# EasyEDA Pro project moss-controller-pcb.eprj, schematic Schematic1

## Sheets
1 P1: Create Date: 2023-03-15; Page Name: P1; Project Name: moss-controller-pcb; Schematic Name: Schematic1; Update Date: 2023-04-03; Company: 嘉立创EDA; Page Size: A4; Version: V1.0
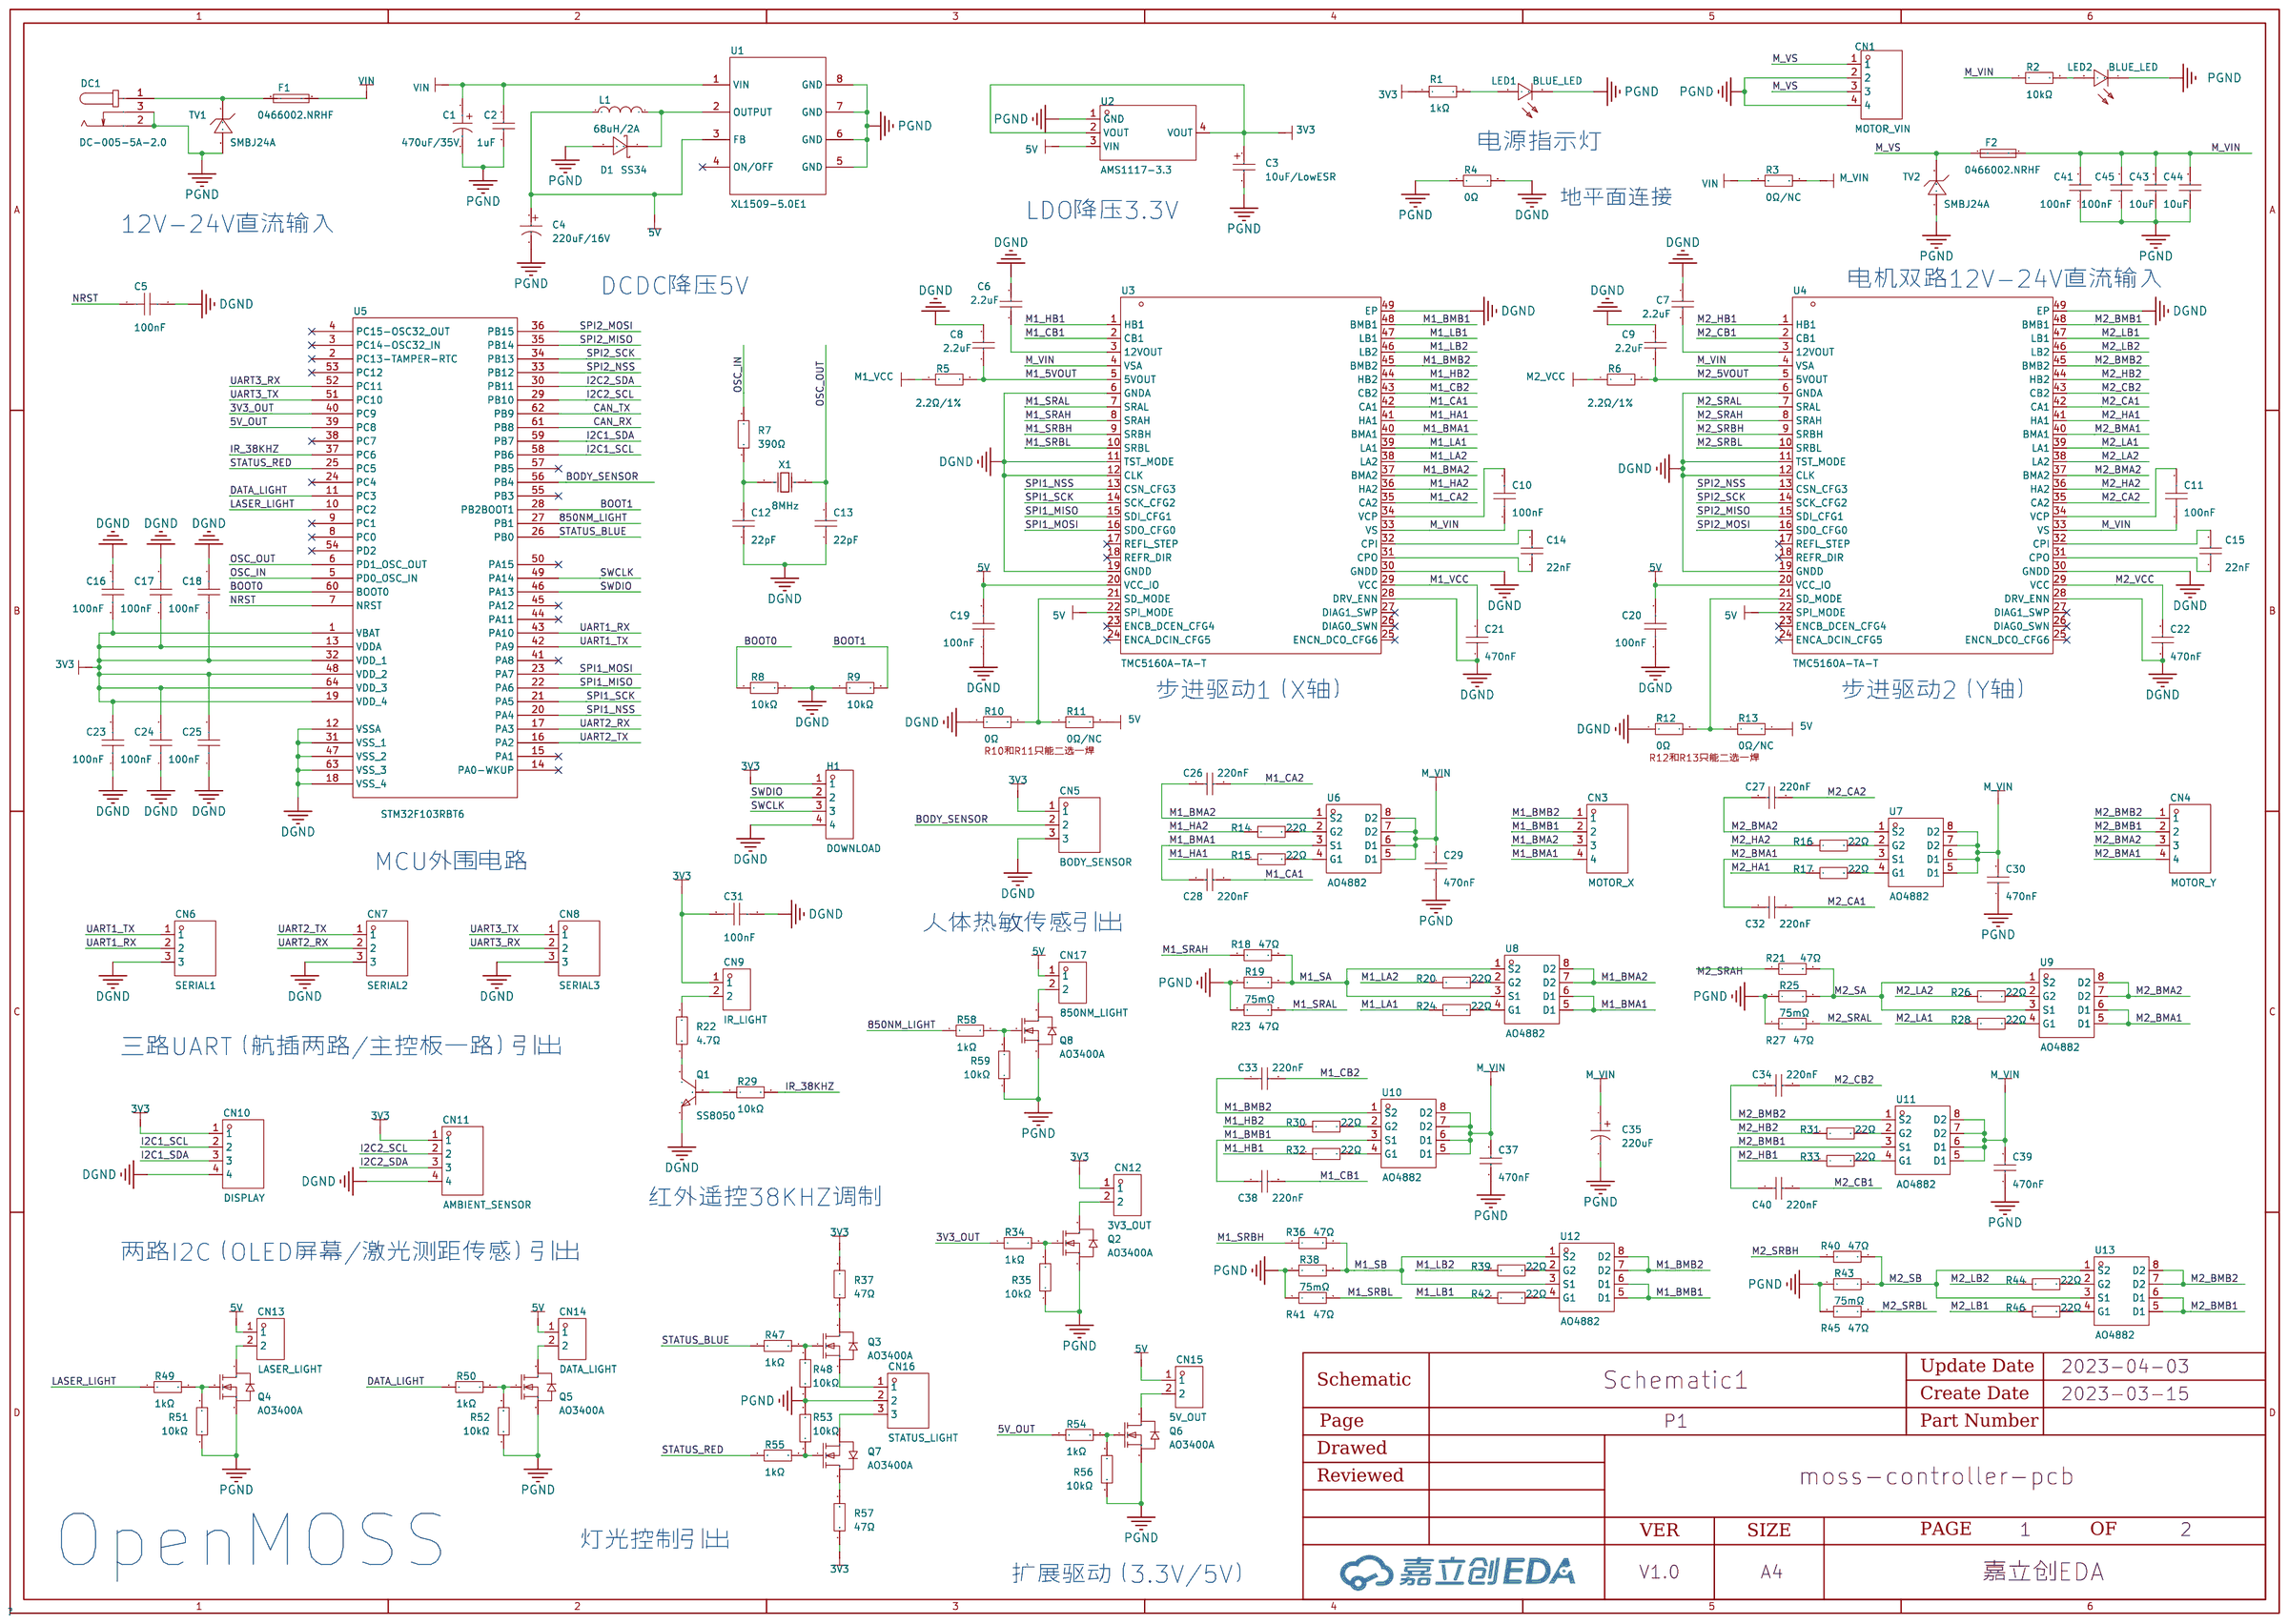
[diagram p0: P1]
2 P2: Create Date: 2023-04-05; Page Name: P2; Update Date: 2023-04-05
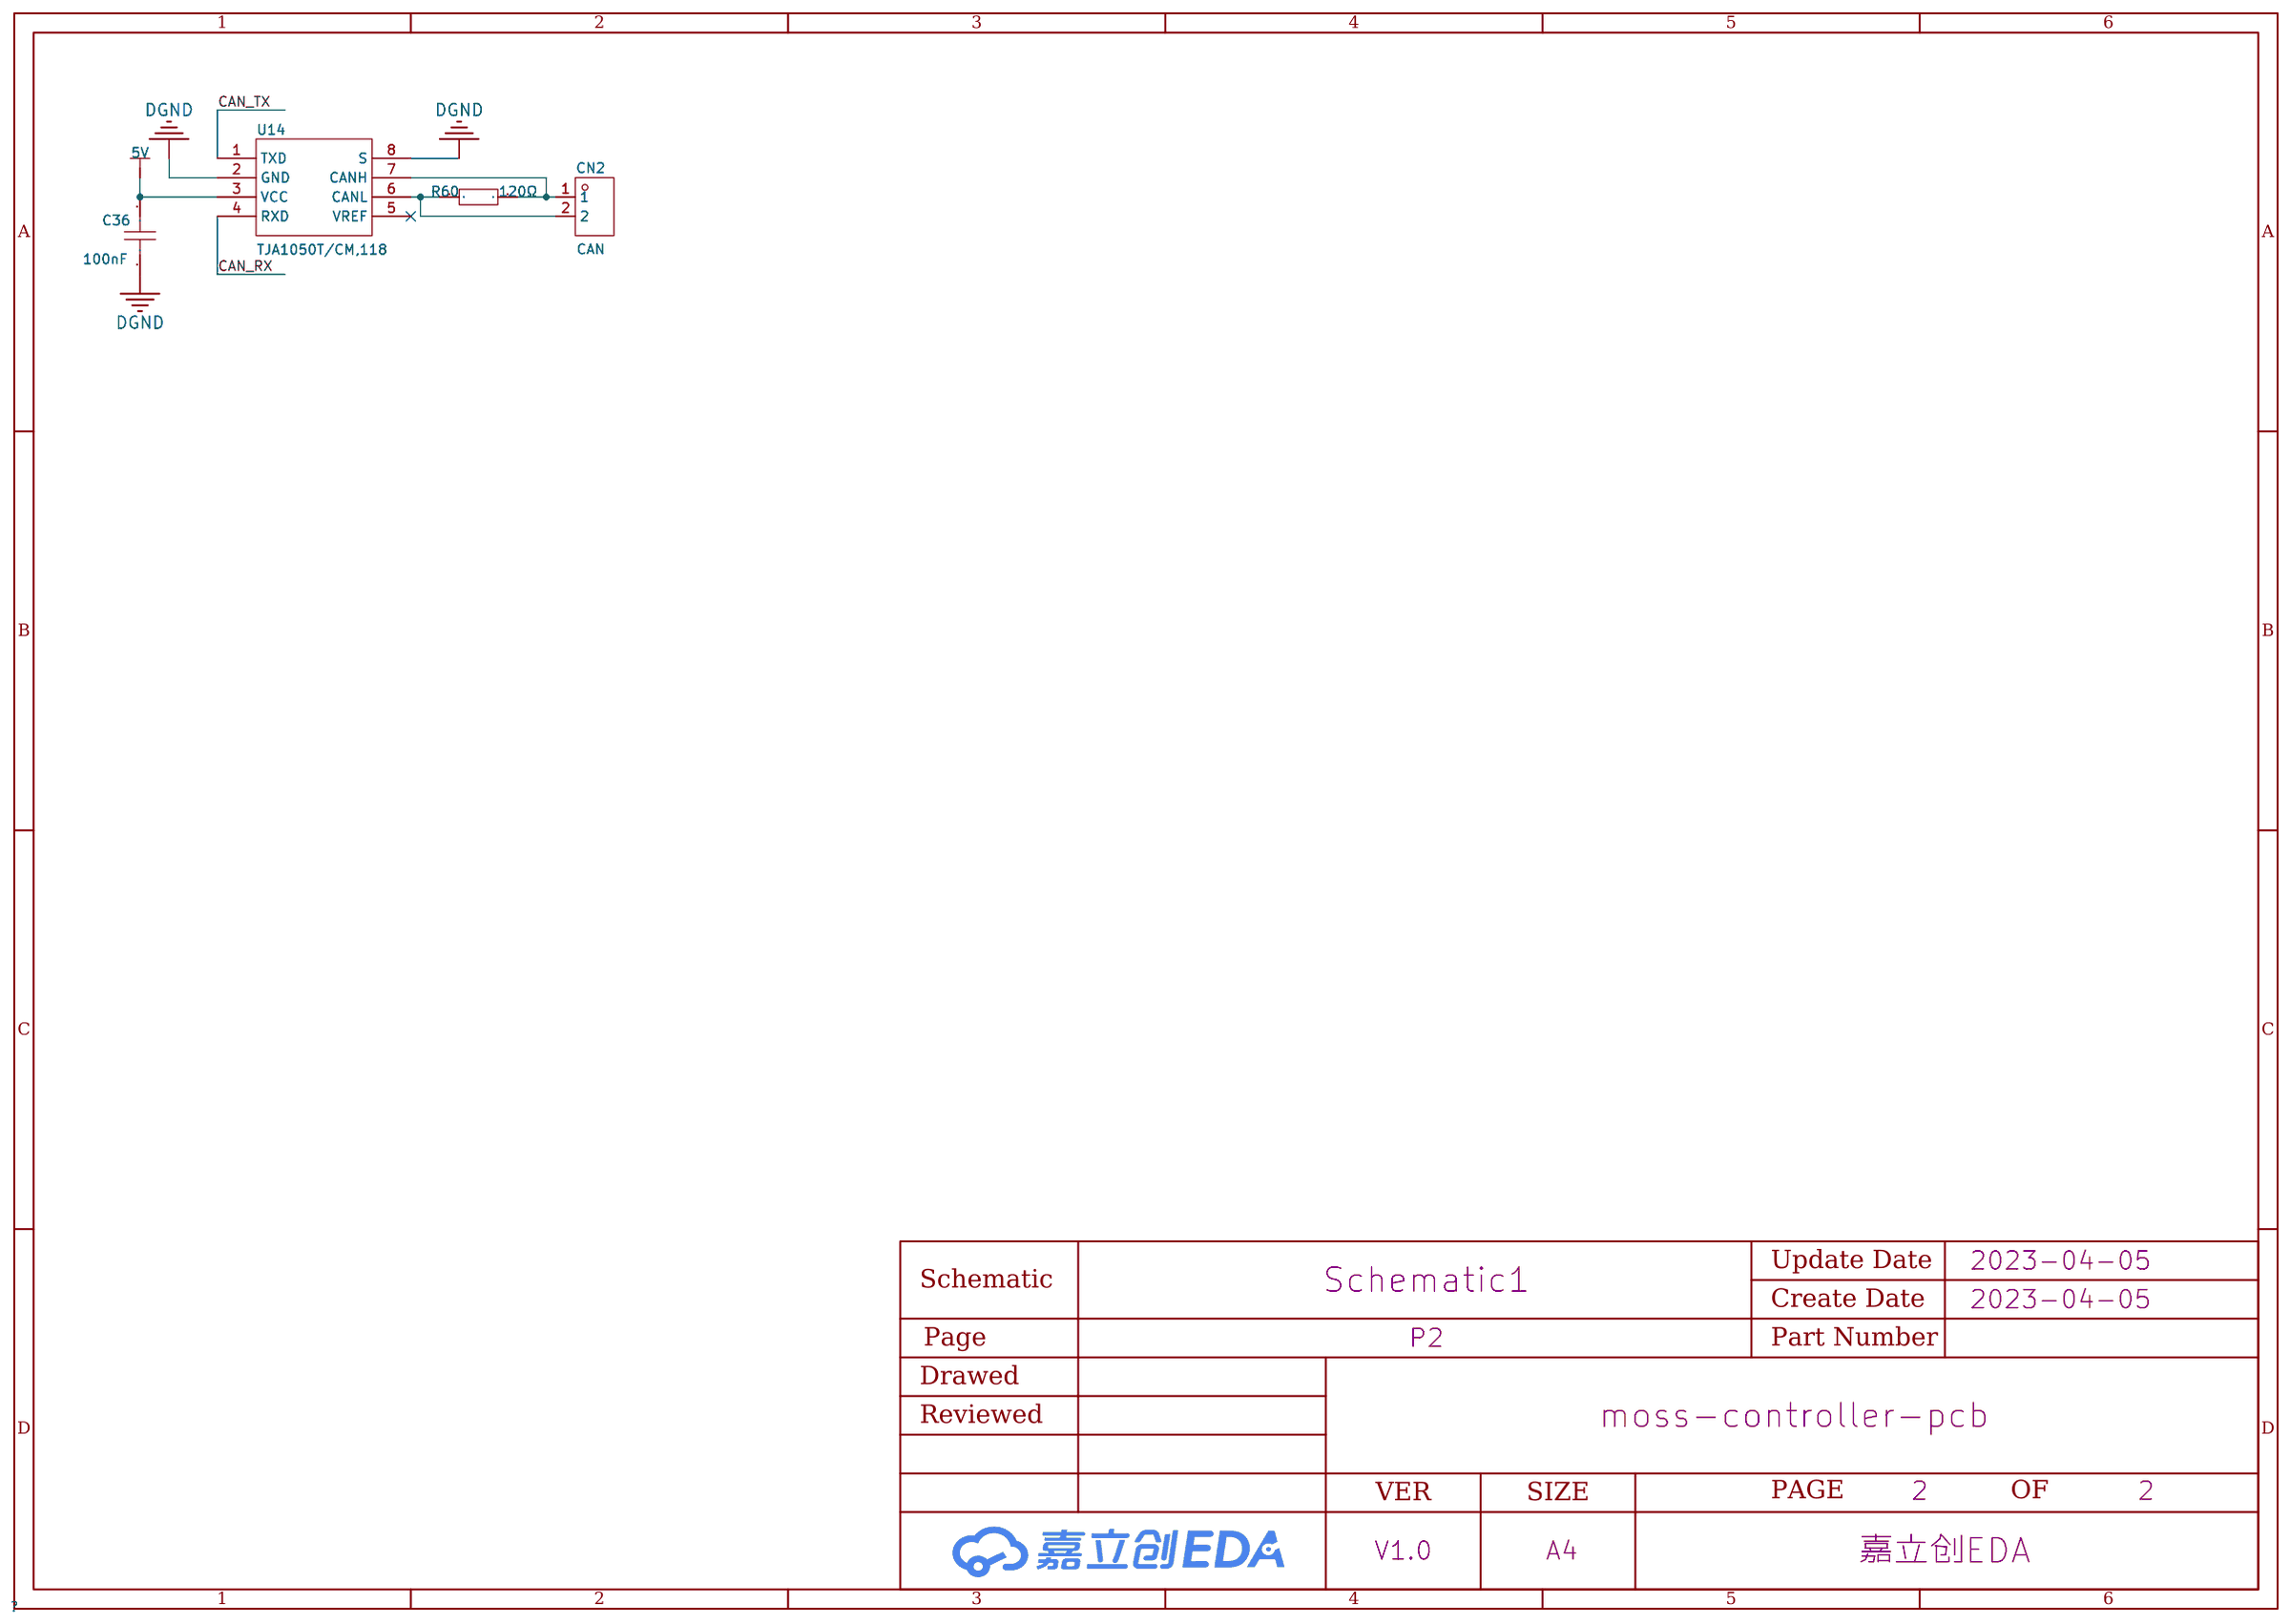
[diagram p1: P2]

## Parts
sheet P1
C1  470uF/35V  [CAP-TH_BD8.0-P3.50-D0.6-FD]
C2  1uF  [C0805]
C3  10uF/LowESR  [CAP-SMD_L3.2-W1.6-RD-C7171]
C4  220uF/16V  [CAP-TH_BD6.3-P2.50-D1.0-FD]
C5  100nF  [C0603]
C6  2.2uF  [C0805]
C7  2.2uF  [C0805]
C8  2.2uF  [C0805]
C9  2.2uF  [C0805]
C10  100nF  [C0603]
C11  100nF  [C0603]
C12  22pF  [C0603]
C13  22pF  [C0603]
C14  22nF  [C0603]
C15  22nF  [C0603]
C16  100nF  [C0603]
C17  100nF  [C0603]
C18  100nF  [C0603]
C19  100nF  [C0603]
C20  100nF  [C0603]
C21  470nF  [C0603]
C22  470nF  [C0603]
C23  100nF  [C0603]
C24  100nF  [C0603]
C25  100nF  [C0603]
C26  220nF  [C0603]
C27  220nF  [C0603]
C28  220nF  [C0603]
C29  470nF  [C0603]
C30  470nF  [C0603]
C31  100nF  [C0603]
C32  220nF  [C0603]
C33  220nF  [C0603]
C34  220nF  [C0603]
C35  220uF  [CAP-TH_BD8.0-P3.50-D0.6-FD-2]
C37  470nF  [C0603]
C38  220nF  [C0603]
C39  470nF  [C0603]
C40  220nF  [C0603]
C41  100nF  [C0805]
C43  10uF  [C1206]
C44  10uF  [C1206]
C45  100nF  [C0805]
CN1  MOTOR_VIN  [CONN-TH_A2501WR-4P]
CN3  MOTOR_X  [CONN-TH_A2501WR-4P]
CN4  MOTOR_Y  [CONN-TH_A2501WR-4P]
CN5  BODY_SENSOR  [CONN-TH_A2501WR-3P]
CN6  SERIAL1  [CONN-TH_A2501WR-3P]
CN7  SERIAL2  [CONN-TH_A2501WR-3P]
CN8  SERIAL3  [CONN-TH_A2501WR-3P]
CN9  IR_LIGHT  [CONN-TH_A2501WRB-2P]
CN10  DISPLAY  [CONN-TH_A2501WR-4P]
CN11  AMBIENT_SENSOR  [CONN-TH_A2501WR-4P]
CN12  3V3_OUT  [CONN-TH_A2501WRB-2P]
CN13  LASER_LIGHT  [CONN-TH_A2501WRB-2P]
CN14  DATA_LIGHT  [CONN-TH_A2501WRB-2P]
CN15  5V_OUT  [CONN-TH_A2501WRB-2P]
CN16  STATUS_LIGHT  [CONN-TH_A2501WR-3P]
CN17  850NM_LIGHT  [CONN-TH_A2501WRB-2P]
D1  SS34  [SMA_L4.3-W2.6-LS5.2-RD]
DC1  DC-005-5A-2.0  [DC-IN-TH_DC-005-5A-2.0]
F1  0466002.NRHF  [F1206]
F2  0466002.NRHF  [F1206]
H1  DOWNLOAD  [HDR-TH_4P-P2.54-V-F-3]
L1  68uH/2A  [IND-SMD_L7.1-W6.6]
LED1  BLUE_LED  [LED0603-RD]
LED2  BLUE_LED  [LED0603-RD]
Q1  SS8050  [SOT-23-3_L2.9-W1.3-P1.90-LS2.4-BR]
Q2  AO3400A  [SOT-23-3_L2.9-W1.3-P1.90-LS2.4-BR]
Q3  AO3400A  [SOT-23-3_L2.9-W1.3-P1.90-LS2.4-BR]
Q4  AO3400A  [SOT-23-3_L2.9-W1.3-P1.90-LS2.4-BR]
Q5  AO3400A  [SOT-23-3_L2.9-W1.3-P1.90-LS2.4-BR]
Q6  AO3400A  [SOT-23-3_L2.9-W1.3-P1.90-LS2.4-BR]
Q7  AO3400A  [SOT-23-3_L2.9-W1.3-P1.90-LS2.4-BR]
Q8  AO3400A  [SOT-23-3_L2.9-W1.3-P1.90-LS2.4-BR]
R1  1kΩ  [R0603]
R2  10kΩ  [R0603]
R3  0Ω/NC  [R1206]
R4  0Ω  [R0805]
R5  2.2Ω/1%  [R0603]
R6  2.2Ω/1%  [R0603]
R7  390Ω  [R0603]
R8  10kΩ  [R0603]
R9  10kΩ  [R0603]
R10  0Ω  [R0603]
R11  0Ω/NC  [R0603]
R12  0Ω  [R0603]
R13  0Ω/NC  [R0603]
R14  22Ω  [R0603]
R15  22Ω  [R0603]
R16  22Ω  [R0603]
R17  22Ω  [R0603]
R18  47Ω  [R0603]
R19  75mΩ  [R1206]
R20  22Ω  [R0603]
R21  47Ω  [R0603]
R22  4.7Ω  [R0603]
R23  47Ω  [R0603]
R24  22Ω  [R0603]
R25  75mΩ  [R1206]
R26  22Ω  [R0603]
R27  47Ω  [R0603]
R28  22Ω  [R0603]
R29  10kΩ  [R0603]
R30  22Ω  [R0603]
R31  22Ω  [R0603]
R32  22Ω  [R0603]
R33  22Ω  [R0603]
R34  1kΩ  [R0603]
R35  10kΩ  [R0603]
R36  47Ω  [R0603]
R37  47Ω  [R0603]
R38  75mΩ  [R1206]
R39  22Ω  [R0603]
R40  47Ω  [R0603]
R41  47Ω  [R0603]
R42  22Ω  [R0603]
R43  75mΩ  [R1206]
R44  22Ω  [R0603]
R45  47Ω  [R0603]
R46  22Ω  [R0603]
R47  1kΩ  [R0603]
R48  10kΩ  [R0603]
R49  1kΩ  [R0603]
R50  1kΩ  [R0603]
R51  10kΩ  [R0603]
R52  10kΩ  [R0603]
R53  10kΩ  [R0603]
R54  1kΩ  [R0603]
R55  1kΩ  [R0603]
R56  10kΩ  [R0603]
R57  47Ω  [R0603]
R58  1kΩ  [R0603]
R59  10kΩ  [R0603]
TV1  SMBJ24A  [SMB_L4.6-W3.6-LS5.3-RD]
TV2  SMBJ24A  [SMB_L4.6-W3.6-LS5.3-RD]
U1  XL1509-5.0E1  [SOIC-8_L5.0-W4.0-P1.27-LS6.0-BL]
U2  AMS1117-3.3  [SOT-223-3_L6.5-W3.4-P2.30-LS7.0-BR]
U3  TMC5160A-TA-T  [TQFP-48_L7.0-W7.0-P0.50-LS9.0-BL-EP]
U4  TMC5160A-TA-T  [TQFP-48_L7.0-W7.0-P0.50-LS9.0-BL-EP]
U5  STM32F103RBT6  [LQFP-64_L10.0-W10.0-P0.50-LS12.0-BL]
U6  AO4882  [SOIC-8_L4.9-W3.9-P1.27-LS6.0-BL]
U7  AO4882  [SOIC-8_L4.9-W3.9-P1.27-LS6.0-BL]
U8  AO4882  [SOIC-8_L4.9-W3.9-P1.27-LS6.0-BL]
U9  AO4882  [SOIC-8_L4.9-W3.9-P1.27-LS6.0-BL]
U10  AO4882  [SOIC-8_L4.9-W3.9-P1.27-LS6.0-BL]
U11  AO4882  [SOIC-8_L4.9-W3.9-P1.27-LS6.0-BL]
U12  AO4882  [SOIC-8_L4.9-W3.9-P1.27-LS6.0-BL]
U13  AO4882  [SOIC-8_L4.9-W3.9-P1.27-LS6.0-BL]
X1  8MHz  [CRYSTAL-SMD_L11.5-W4.8-LS12.7]
sheet P2
C36  100nF  [C0603]
CN2  CAN  [CONN-TH_A2501WRB-2P]
R60  120Ω  [R0603]
U14  TJA1050T/CM,118  [SOIC-8_L5.0-W4.0-P1.27-LS6.0-BL]

## Library data of the parts
C1 = SPT1VM471F14OR: 类型:-;容值:470uF;精度:±20%;额定电压:35V;电容体直径:8mm;电容体长度:14mm;脚间距:3.5mm;纹波电流:-;等效串联电阻:-;工作寿命:2000hrs@105℃;工作温度:-55℃~+105℃;; LCSC Part Name: 470uF ±20% 35V; Supplier Part: C698134; Manufacturer: Yunxing(云星); Supplier Footprint: 插件,8x14mm; JLCPCB Part Class: Extended Part; Datasheet: https://atta.szlcsc.com/upload/public/pdf/source/20200709/C697725_42901235359D2F905A7BBBDFFA1D5D23.pdf; Supplier: LCSC; Tolerance: ±20%; Rated Voltage: 35V; φD: 8mm; L: 14mm; Lead Spacing: 3.5mm; Lifetime @ Temp: 2000hrs@105℃; Operating Temperature: -55℃~+105℃
C2 = CL21B105KBFNNNE: 容值:1uF;精度:±10%;额定电压:50V;材质(温度系数):X7R;; LCSC Part Name: 1uF ±10% 50V; Supplier Part: C28323; Manufacturer: SAMSUNG(三星); Supplier Footprint: 0805; JLCPCB Part Class: Basic Part; Datasheet: https://atta.szlcsc.com/upload/public/pdf/source/20160103/1457707718219.pdf; Supplier: LCSC; Tolerance: ±10%; Voltage Rated: 50V; Temperature Coefficient: X7R
C3 = TAJA106K016RNJ: 容值:10uF;精度:±10%;额定电压:16V;等效串联电阻:3Ω@100kHz;工作温度:-55℃~+125℃;; LCSC Part Name: 10uF ±10% 16V; Supplier Part: C7171; Manufacturer: Kyocera AVX; Supplier Footprint: CASE-A-3216; JLCPCB Part Class: Basic Part; Datasheet: https://atta.szlcsc.com/upload/public/pdf/source/20160107/1457707748093.pdf; Supplier: LCSC; Tolerance: ±10%; Rated Voltage: 16V; Equivalent Series Resistance(ESR): 3Ω@100kHz; Operating Temperature: -55℃~+125℃
C4 = SPZ1CM221E08O00RAXXX: 类型:-;容值:220uF;精度:±20%;额定电压:16V;电容体直径:6.3mm;电容体长度:8mm;脚间距:2.5mm;纹波电流:2.7A@100kHz;等效串联电阻:20mΩ@100kHz;工作寿命:2000hrs@105℃;工作温度:-55℃~+105℃;; LCSC Part Name: 220uF ±20% 16V; Supplier Part: C122241; Manufacturer: AISHI(艾华集团); Supplier Footprint: 径向引线,6.3x8mm; JLCPCB Part Class: Extended Part; Datasheet: https://atta.szlcsc.com/upload/public/pdf/source/20170721/C122241_1500619281644834030.pdf; Supplier: LCSC; Tolerance: ±20%; Rated Voltage: 16V; φD: 6.3mm; L: 8mm; Lead Spacing: 2.5mm; Ripple Current: 2.7A@100kHz; Equivalent Series Resistance(ESR): 20mΩ@100kHz; Lifetime @ Temp: 2000hrs@105℃; Operating Temperature: -55℃~+105℃
C5 C10 C11 C16-C20 C23-C25 C31 C36 = CL10B104KB8NNNC: 容值:100nF;精度:±10%;额定电压:50V;材质(温度系数):X7R;; LCSC Part Name: 100nF ±10% 50V; Supplier Part: C1591; Manufacturer: SAMSUNG(三星); Supplier Footprint: 0603; JLCPCB Part Class: Extended Part; Datasheet: https://atta.szlcsc.com/upload/public/pdf/source/20160103/1457707680512.pdf; Supplier: LCSC; Tolerance: ±10%; Voltage Rated: 50V; Temperature Coefficient: X7R
C6-C9 = 0805F225M500NT: 容值:2.2uF;精度:±20%;额定电压:50V;材质(温度系数):Y5V;; LCSC Part Name: 2.2uF ±20% 50V; Supplier Part: C49217; Manufacturer: FH(风华); Supplier Footprint: 0805; JLCPCB Part Class: Basic Part; Datasheet: https://atta.szlcsc.com/upload/public/pdf/source/20170923/C49217_1506149476408988807.pdf; Supplier: LCSC; Tolerance: ±20%; Voltage Rated: 50V; Temperature Coefficient: Y5V
C12 C13 = CL10C220JB8NNNC: 容值:22pF;精度:±5%;额定电压:50V;材质(温度系数):C0G;; LCSC Part Name: 22pF ±5% 50V; Supplier Part: C1653; Manufacturer: SAMSUNG(三星); Supplier Footprint: 0603; JLCPCB Part Class: Basic Part; Datasheet: https://atta.szlcsc.com/upload/public/pdf/source/20160103/1457707687317.pdf; Supplier: LCSC; Tolerance: ±5%; Voltage Rated: 50V; Temperature Coefficient: C0G
C14 C15 = CL10B223KB8NNNC: 容值:22nF;精度:±10%;额定电压:50V;材质(温度系数):X7R;; LCSC Part Name: 22nF ±10% 50V; Supplier Part: C21122; Manufacturer: SAMSUNG(三星); Supplier Footprint: 0603; JLCPCB Part Class: Basic Part; Datasheet: https://atta.szlcsc.com/upload/public/pdf/source/20160103/1457707705232.pdf; Supplier: LCSC; Tolerance: ±10%; Voltage Rated: 50V; Temperature Coefficient: X7R
C21 C22 C29 C30 C37 C39 = CL10B474KA8NNNC: 容值:470nF;精度:±10%;额定电压:25V;材质(温度系数):X7R;; LCSC Part Name: 470nF ±10% 25V; Supplier Part: C1623; Manufacturer: SAMSUNG(三星); Supplier Footprint: 0603; JLCPCB Part Class: Basic Part; Datasheet: https://atta.szlcsc.com/upload/public/pdf/source/20160103/1457707685435.pdf; Supplier: LCSC; Tolerance: ±10%; Voltage Rated: 25V; Temperature Coefficient: X7R
C26-C28 C32-C34 C38 C40 = CL10B224KA8NNNC: 容值:220nF;精度:±10%;额定电压:25V;材质(温度系数):X7R;; LCSC Part Name: 220nF ±10% 25V; Supplier Part: C21120; Manufacturer: SAMSUNG(三星); Supplier Footprint: 0603; JLCPCB Part Class: Basic Part; Datasheet: https://atta.szlcsc.com/upload/public/pdf/source/20160103/1457707705031.pdf; Supplier: LCSC; Tolerance: ±10%; Voltage Rated: 25V; Temperature Coefficient: X7R
C35 = KNH2220UF35V149EC0049: 容值:220uF;精度:±20%;额定电压:35V;电容体直径:8mm;电容体长度:9mm;脚间距:3.5mm;纹波电流:1.7A@100kHz;等效串联电阻:40mΩ@100kHz;工作寿命:2000hrs@105℃;工作温度:-55℃~+105℃;; LCSC Part Name: 220uF ±20% 35V; Supplier Part: C2981462; Manufacturer: KNSCHA(科尼盛); Supplier Footprint: 径向引线,8x9mm; JLCPCB Part Class: Extended Part; Datasheet: https://atta.szlcsc.com/upload/public/pdf/source/20220426/9FC8A158D93B909CC105160B4A0CB698.pdf; Supplier: LCSC; Tolerance: ±20%; Rated Voltage: 35V; φD: 8mm; L: 9mm; Lead Spacing: 3.5mm; Ripple Current: 1.7A@100kHz; Equivalent Series Resistance(ESR): 40mΩ@100kHz; Lifetime @ Temp: 2000hrs@105℃; Operating Temperature: -55℃~+105℃
C41 C45 = CC0805KRX7R9BB104: 容值:100nF;精度:±10%;额定电压:50V;材质(温度系数):X7R;; LCSC Part Name: 100nF ±10% 50V; Supplier Part: C49678; Manufacturer: YAGEO(国巨); Supplier Footprint: 0805; JLCPCB Part Class: Basic Part; Datasheet: https://atta.szlcsc.com/upload/public/pdf/source/20151026/1457707504898.pdf; Supplier: LCSC; Tolerance: ±10%; Voltage Rated: 50V; Temperature Coefficient: X7R
C43 C44 = CL31A106KBHNNNE: 容值:10uF;精度:±10%;额定电压:50V;材质(温度系数):X5R;; LCSC Part Name: 10uF ±10% 50V; Supplier Part: C13585; Manufacturer: SAMSUNG(三星); Supplier Footprint: 1206; JLCPCB Part Class: Basic Part; Datasheet: https://atta.szlcsc.com/upload/public/pdf/source/20160103/1457707668742.pdf; Supplier: LCSC; Tolerance: ±10%; Voltage Rated: 50V; Temperature Coefficient: X5R
CN1 CN3 CN4 CN10 CN11 = A2501WR-4P: 参考系列:XH;间距:2.5mm;插针结构:1x4P;排数:1;每排PIN数:4;行距:-;安装方式:-;触头材质:黄铜;; LCSC Part Name: XH 2.5mm 1x4P 镀锡; Supplier Part: C225401; Manufacturer: CJT(长江连接器); Supplier Footprint: 弯插,P=2.5mm; JLCPCB Part Class: Extended Part; Datasheet: https://atta.szlcsc.com/upload/public/pdf/source/20180509/C225401_3AFE88A4096D5C39E59878F7D4C1EC6D.pdf; Supplier: LCSC; Reference Series: XH; Pitch: 2.5mm; Pins Structure: 1x4P; Number of Rows: 1; Number of PINs Per Row: 4; Contact Material: 黄铜
CN5-CN8 CN16 = A2501WR-3P: 参考系列:XH;间距:2.5mm;插针结构:1x3P;排数:1;每排PIN数:3;行距:-;安装方式:-;触头材质:黄铜;; LCSC Part Name: XH 2.5mm 1x3P 镀锡; Supplier Part: C225400; Manufacturer: CJT(长江连接器); Supplier Footprint: 插件,P=2.5mm; JLCPCB Part Class: Extended Part; Datasheet: https://atta.szlcsc.com/upload/public/pdf/source/20180509/C225400_702E0154C4A2B4B6D4A16C0687A1836E.pdf; Supplier: LCSC; Reference Series: XH; Pitch: 2.5mm; Pins Structure: 1x3P; Number of Rows: 1; Number of PINs Per Row: 3; Contact Material: 黄铜
CN2 CN9 CN12-CN15 CN17 = A2501WRB-2P: 参考系列:XH;间距:2.5mm;插针结构:1x2P;排数:1;每排PIN数:2;行距:-;安装方式:-;触头材质:黄铜;; LCSC Part Name: XH 2.5mm 1x2P 镀锡; Supplier Part: C273216; Manufacturer: CJT(长江连接器); Supplier Footprint: 插件,P=2.5mm; JLCPCB Part Class: Extended Part; Datasheet: https://atta.szlcsc.com/upload/public/pdf/source/20180913/C273216_C0F0FBC6365BAF736D2CFBE208868BED.pdf; Supplier: LCSC; Reference Series: XH; Pitch: 2.5mm; Pins Structure: 1x2P; Number of Rows: 1; Number of PINs Per Row: 2; Contact Material: 黄铜
D1 = SS34_C8678: 二极管配置:独立式;直流反向耐压(Vr):40V;平均整流电流(Io):3A;正向压降(Vf):550mV@3A;反向电流(Ir):500uA@40V;; LCSC Part Name: 40V 3A 550mV@3A; Supplier Part: C8678; Manufacturer: MDD; Supplier Footprint: SMA(DO-214AC); JLCPCB Part Class: Basic Part; Datasheet: https://atta.szlcsc.com/upload/public/pdf/source/20230314/A80AE34493C69B89E2F4B1712F433538.pdf; Supplier: LCSC; Diode Configuration: 独立式; Reverse Voltage (Vr): 40V; Average Rectified Current (Io): 3A; Forward Voltage (Vf@If): 550mV@3A; Reverse Leakage Current (Ir): 500uA@40V
DC1 = DC-005-5A-2.0: 连接器类型:DC电源插座;触点内径:2mm;触点外径:6.2mm;额定电流:5A;额定电压:24V;触头材质:黄铜;工作温度范围:-20℃~+70℃;焊接温度(最大值):260℃;; LCSC Part Name: DC电源插座 内径:2mm 外径:6.2mm; Supplier Part: C381116; Manufacturer: XKB Connectivity(中国星坤); Supplier Footprint: 插件; JLCPCB Part Class: Extended Part; Datasheet: https://atta.szlcsc.com/upload/public/pdf/source/20211015/707A35F7AB6E89C57AAB641950105BB7.pdf; Supplier: LCSC; Connector Type: DC电源插座; Inside Contact Diameter: 2mm; Outside Contact Diameter: 6.2mm; Current Rating (Max): 5A; Voltage Rating (Max): 24V; Contact Material: 黄铜; Operating Temperature Range: -20℃~+70℃; Welding Temperature (Max): 260℃
F1 F2 = 0466002.NRHF: 类型:贴片式保险丝;额定电流:2A;额定电压 (AC):63V;额定电压 (DC):63V;分断能力:50A;工作温度:-55℃~+90℃;; LCSC Part Name: 2A 63V 快断; Supplier Part: C3105; Manufacturer: Littelfuse(美国力特); Supplier Footprint: 1206; JLCPCB Part Class: Extended Part; Datasheet: https://atta.szlcsc.com/upload/public/pdf/source/20151106/1457707546362.pdf; Supplier: LCSC; Type: 贴片式保险丝; Current Rating: 2A; Voltage Rating  (AC): 63V; Voltage Rating (DC): 63V; Breaking Capacity: 50A; Operating Temperature: -55℃~+90℃
H1 = MF254V-11-04-0540: 排数:单排;总孔位数:4;间距:2.54mm;插孔结构:1x4P;行距:-;安装类型:直插;圆孔/方孔:圆孔;额定电流:3A;额定电压:-;插孔方向:顶部;塑高:3mm;工作温度范围:-40℃~+105℃;; LCSC Part Name: 2.54mm 1x4P; Supplier Part: C509262; Manufacturer: XFCN(兴飞); Supplier Footprint: 插件,P=2.54mm; JLCPCB Part Class: Extended Part; Datasheet: https://atta.szlcsc.com/upload/public/pdf/source/20200407/C509262_774DD75DBF2E5657535A5D67C193029B.pdf; Supplier: LCSC; Number of Rows: 单排; Number of Holes: 4; Pitch: 2.54mm; Holes Structure: 1x4P; Mounting Type: 直插; Circular Hole / Square Hole: 圆孔; Current Rating (Max): 3A; Holes Direction: 顶部; Insulation Height: 3mm; Operating Temperature Range: -40℃~+105℃
L1 = SMMS0650-680M: 电感值:68uH;精度:±20%;额定电流:1.5A;饱和电流(Isat):2A;直流电阻(DCR):340mΩ;; LCSC Part Name: 68uH ±20% 1.5A 340mΩ; Supplier Part: C2894721; Manufacturer: SXN(顺翔诺); Supplier Footprint: SMD,6.6x7.1mm; JLCPCB Part Class: Extended Part; Datasheet: https://atta.szlcsc.com/upload/public/pdf/source/20210910/523B6BB0C4A09F37806A127B1ABE761D.pdf; Supplier: LCSC; Tolerance: ±20%; Rated Current: 1.5A; Saturation Current (Isat): 2A; DC Resistance (DCR): 340mΩ
LED1 LED2 = 19-217/BHC-ZL1M2RY/3T: 照明颜色:蓝色;主波长/色坐标:465~475nm;; LCSC Part Name: 0603 蓝灯; Supplier Part: C72041; Manufacturer: EVERLIGHT(亿光); Supplier Footprint: 0603; JLCPCB Part Class: Basic Part; Datasheet: https://atta.szlcsc.com/upload/public/pdf/source/20170116/1484561237273.pdf; Supplier: LCSC; Mounting Type: 表面贴装; Illumination Color: 蓝色; Luminous Intensity (IF=20mA): 11.5~28.5mcd@5mA; Dominant Wavelength / Coordinate rank: 465~475nm
Q1 = SS8050_C2150: 晶体管类型:NPN;集射极击穿电压(Vceo):25V;集电极电流(Ic):1.5A;功率(Pd):300mW;直流电流增益(hFE@Ic,Vce):200@100mA,1V;; LCSC Part Name: NPN 25V 1.5A Y1 200-350; Supplier Part: C2150; Manufacturer: CJ(江苏长电/长晶); Supplier Footprint: SOT-23; JLCPCB Part Class: Basic Part; Datasheet: https://atta.szlcsc.com/upload/public/pdf/source/20230322/AEE86F4B043774EFF80CAEA14A37D9E9.pdf; Supplier: LCSC; Transistor Type: NPN; Collector-Emitter Breakdown Voltage (Vceo): 25V; Collector Current (Ic): 1.5A; Power Dissipation (Pd): 300mW; Collector Cut-Off Current (Icbo): 100nA; Collector-Emitter Saturation Voltage (VCE(sat)@Ic,Ib): 500mV@800mA,80mA; DC Current Gain (hFE@Ic,Vce): 200@100mA,1V; Transition Frequency (fT): 100MHz; Operating Temperature: +150℃@(Tj)
Q2-Q8 = AO3400A_C347475: 类型:N沟道;漏源电压(Vdss):30V;连续漏极电流(Id):5.8A;功率(Pd):1.4W;导通电阻(RDS(on)@Vgs,Id):35mΩ@10V,5.8A;阈值电压(Vgs(th)@Id):1.4V@250uA;栅极电荷(Qg@Vgs):-;输入电容(Ciss@Vds):-;反向传输电容(Crss@Vds):-;; LCSC Part Name: N沟道 30V 5.8A; Supplier Part: C347475; Manufacturer: UMW(广东友台半导体); Supplier Footprint: SOT-23; JLCPCB Part Class: Extended Part; Datasheet: https://atta.szlcsc.com/upload/public/pdf/source/20220429/98B7D6B2B83615ED4523A0C76368EB06.pdf; Supplier: LCSC; Type: N沟道; Drain Source Voltage (Vdss): 30V; Continuous Drain Current (Id): 5.8A; Power Dissipation (Pd): 1.4W; Drain Source On Resistance (RDS(on)@Vgs,Id): 35mΩ@10V,5.8A; Gate Threshold Voltage (Vgs(th)@Id): 1.4V@250uA
R1 R34 R47 R49 R50 R54 R55 R58 = 0603WAF1001T5E: 电阻类型:厚膜电阻;阻值:1kΩ;精度:±1%;功率:100mW;温度系数:±100ppm/℃;最大工作电压:75V;工作温度范围:-55℃~+155℃;; LCSC Part Name: 1kΩ ±1% 100mW; Supplier Part: C21190; Manufacturer: UNI-ROYAL(厚声); Supplier Footprint: 0603; JLCPCB Part Class: Basic Part; Datasheet: https://atta.szlcsc.com/upload/public/pdf/source/20200306/C422600_1E6D84923E4A46A82E41ADD87F860B5C.pdf; Supplier: LCSC; Type: 厚膜电阻; Tolerance: ±1%; Power(Watts): 100mW; Temperature Coefficient: ±100ppm/℃; Overload Voltage (Max): 75V; Operating Temperature Range: -55℃~+155℃
R2 R8 R9 R29 R35 R48 R51-R53 R56 R59 = 0603WAF1002T5E: 电阻类型:厚膜电阻;阻值:10kΩ;精度:±1%;功率:100mW;温度系数:±100ppm/℃;最大工作电压:75V;工作温度范围:-55℃~+155℃;; LCSC Part Name: 10kΩ ±1% 100mW; Supplier Part: C25804; Manufacturer: UNI-ROYAL(厚声); Supplier Footprint: 0603; JLCPCB Part Class: Basic Part; Datasheet: https://atta.szlcsc.com/upload/public/pdf/source/20200306/C422600_1E6D84923E4A46A82E41ADD87F860B5C.pdf; Supplier: LCSC; Type: 厚膜电阻; Tolerance: ±1%; Power(Watts): 100mW; Temperature Coefficient: ±100ppm/℃; Overload Voltage (Max): 75V; Operating Temperature Range: -55℃~+155℃
R3 = 1206W4F0000T5E: 电阻类型:厚膜电阻;阻值:0Ω;精度:±1%;功率:250mW;温度系数:±800ppm/℃;最大工作电压:200V;工作温度范围:-55℃~+155℃;; LCSC Part Name: 0Ω ±1% 250mW; Supplier Part: C17888; Manufacturer: UNI-ROYAL(厚声); Supplier Footprint: 1206; JLCPCB Part Class: Basic Part; Datasheet: https://atta.szlcsc.com/upload/public/pdf/source/20200306/C422600_1E6D84923E4A46A82E41ADD87F860B5C.pdf; Supplier: LCSC; Type: 厚膜电阻; Tolerance: ±1%; Power(Watts): 250mW; Temperature Coefficient: ±800ppm/℃; Overload Voltage (Max): 200V; Operating Temperature Range: -55℃~+155℃
R4 = 0805W8F0000T5E: 电阻类型:厚膜电阻;阻值:0Ω;精度:±1%;功率:125mW;温度系数:±800ppm/℃;最大工作电压:150V;工作温度范围:-55℃~+155℃;; LCSC Part Name: 0Ω ±1% 125mW; Supplier Part: C17477; Manufacturer: UNI-ROYAL(厚声); Supplier Footprint: 0805; JLCPCB Part Class: Basic Part; Datasheet: https://atta.szlcsc.com/upload/public/pdf/source/20200306/C422600_1E6D84923E4A46A82E41ADD87F860B5C.pdf; Supplier: LCSC; Type: 厚膜电阻; Tolerance: ±1%; Power(Watts): 125mW; Temperature Coefficient: ±800ppm/℃; Overload Voltage (Max): 150V; Operating Temperature Range: -55℃~+155℃
R5 R6 = 0603WAF220KT5E: LCSC Part Name: 2.2Ω(2R20) ±1% 编带; Supplier Part: C22939; Manufacturer: UNI-ROYAL(厚声); Supplier Footprint: 0603; JLCPCB Part Class: Basic Part; Datasheet: https://atta.szlcsc.com/upload/public/pdf/source/20170920/C22939_1505900994379982327.pdf; Supplier: LCSC
R7 = 0603WAF3900T5E: 精度:±1%;温度系数:±100ppm/℃;功率:1/10W;阻值:390Ω;最大工作电压:75V;工作温度范围:-55℃~+155℃;; LCSC Part Name: 390Ω ±1%; Supplier Part: C23151; Manufacturer: UNI-ROYAL(厚声); Supplier Footprint: 0603; JLCPCB Part Class: Basic Part; Datasheet: https://atta.szlcsc.com/upload/public/pdf/source/20170920/C23151_1505901103965982535.pdf; Supplier: LCSC; Tolerance: ±1%; Temperature Coefficient: ±100ppm/℃; Power(Watts): 1/10W; Overload Voltage (Max): 75V; Operating Temperature Range: -55℃~+155℃
R10-R13 = 0603WAF0000T5E: 电阻类型:厚膜电阻;阻值:0Ω;精度:±1%;功率:100mW;最大工作电压:75V;工作温度范围:-55℃~+155℃;; LCSC Part Name: 0Ω ±1% 100mW; Supplier Part: C21189; Manufacturer: UNI-ROYAL(厚声); Supplier Footprint: 0603; JLCPCB Part Class: Basic Part; Datasheet: https://atta.szlcsc.com/upload/public/pdf/source/20200306/C422600_1E6D84923E4A46A82E41ADD87F860B5C.pdf; Supplier: LCSC; Type: 厚膜电阻; Tolerance: ±1%; Power(Watts): 100mW; Overload Voltage (Max): 75V; Operating Temperature Range: -55℃~+155℃
R14-R17 R20 R24 R26 R28 R30-R33 R39 R42 R44 R46 = 0603WAF220JT5E: 电阻类型:厚膜电阻;阻值:22Ω;精度:±1%;功率:100mW;温度系数:±100ppm/℃;最大工作电压:75V;工作温度范围:-55℃~+155℃;; LCSC Part Name: 22Ω ±1% 100mW; Supplier Part: C23345; Manufacturer: UNI-ROYAL(厚声); Supplier Footprint: 0603; JLCPCB Part Class: Basic Part; Datasheet: https://atta.szlcsc.com/upload/public/pdf/source/20200306/C422600_1E6D84923E4A46A82E41ADD87F860B5C.pdf; Supplier: LCSC; Type: 厚膜电阻; Tolerance: ±1%; Power(Watts): 100mW; Temperature Coefficient: ±100ppm/℃; Overload Voltage (Max): 75V; Operating Temperature Range: -55℃~+155℃
R18 R21 R23 R27 R36 R37 R40 R41 R45 R57 = 0603WAF470JT5E: 精度:±1%;温度系数:±100ppm/℃;阻值:47Ω;功率:1/10W;最大工作电压:75V;工作温度范围:-55℃~+155℃;; LCSC Part Name: 47Ω ±1%; Supplier Part: C23182; Manufacturer: UNI-ROYAL(厚声); Supplier Footprint: 0603; JLCPCB Part Class: Basic Part; Datasheet: https://atta.szlcsc.com/upload/public/pdf/source/20170920/C23182_1505901119737982565.pdf; Supplier: LCSC; Tolerance: ±1%; Temperature Coefficient: ±100ppm/℃; Power(Watts): 1/10W; Overload Voltage (Max): 75V; Operating Temperature Range: -55℃~+155℃
R19 R25 R38 R43 = 1206W4J075LT5E: 阻值:75mΩ;精度:±5%;功率:250mW;温度系数:±800ppm/℃;; LCSC Part Name: 75mΩ ±5% 250mW; Supplier Part: C127711; Manufacturer: UNI-ROYAL(厚声); Supplier Footprint: 1206; JLCPCB Part Class: Extended Part; Datasheet: https://atta.szlcsc.com/upload/public/pdf/source/20170821/C127711_1503303445338901692.pdf; Supplier: LCSC; Tolerance: ±5%; Power(Watts): 250mW; Temperature Coefficient: ±800ppm/℃
R22 = 0603WAF470KT5E: LCSC Part Name: 4.7Ω(4R70) ±1% 编带; Supplier Part: C23164; Manufacturer: UNI-ROYAL(厚声); Supplier Footprint: 0603; JLCPCB Part Class: Basic Part; Datasheet: https://atta.szlcsc.com/upload/public/pdf/source/20170920/C23164_1505901110674982547.pdf; Supplier: LCSC
TV1 TV2 = SMBJ24A_C87268: 极性:单向;反向截止电压(Vrwm):24V;击穿电压(最小值):26.7V;峰值脉冲电流(Ipp)@10/1000s:15.5A;最大钳位电压:38.9V;; LCSC Part Name: 单向 Vrwm:24V; Supplier Part: C87268; Manufacturer: Brightking(君耀电子); Supplier Footprint: SMB(DO-214AA); JLCPCB Part Class: Extended Part; Datasheet: https://atta.szlcsc.com/upload/public/pdf/source/20161123/1479873102111.pdf; Supplier: LCSC; Polarity: 单向; Reverse Stand-Off Voltage (Vrwm): 24V; Breakdown Voltage (Min): 26.7V; Peak Pulse Current (Ipp)@10/1000μs: 15.5A; Maximum Clamping Voltage: 38.9V
U1 = XL1509-5.0E1: 功能类型:降压型;同步整流:-;输出通道数:-;拓扑结构:-;输入电压:-;输出电流(最大值):-;开关频率:-;; LCSC Part Name: 降压型; Supplier Part: C61063; Manufacturer: XLSEMI(芯龙); Supplier Footprint: SOIC-8; JLCPCB Part Class: Basic Part; Datasheet: https://atta.szlcsc.com/upload/public/pdf/source/20151020/1457707483545.pdf; Supplier: LCSC; Function: 降压型
U2 = AMS1117-3.3_C6186: 输出类型:固定;输出极性:正;输出通道数:1;最大输入电压:-;输出电压:3.3V;压差:1.3V@(800mA);静态电流(地电流):-;输出电流:1A;电源纹波抑制比(PSRR):72dB@(120Hz);噪声:-;特性:-;工作温度:-;; LCSC Part Name: 正 Vout=3.3V 1A 72dB@(120Hz); Supplier Part: C6186; Manufacturer: AMS; Supplier Footprint: SOT-223-3; JLCPCB Part Class: Basic Part; Datasheet: https://atta.szlcsc.com/upload/public/pdf/source/20180727/C6186_7A095716F0823C02F1997A905E26C086.pdf; Supplier: LCSC; Output Type: 固定; Output Polarity: 正; Number of Outputs: 1; Output Voltage: 3.3V; Dropout Voltage: 1.3V@(800mA); Output Current: 1A; Power Supply Rejection Ratio (PSRR): 72dB@(120Hz)
U3 U4 = TMC5160A-TA-T: 电源电压:10V~50V;输出电流:20A;接口:SPI,STEP/DIR;; LCSC Part Name: 电机驱动; Supplier Part: C516354; Manufacturer: TRINAMIC; Supplier Footprint: TQFP-48(7x7); JLCPCB Part Class: Extended Part; Datasheet: https://atta.szlcsc.com/upload/public/pdf/source/20200417/C516354_BECAA87711A87E806AE4E46ED4C12B5A.pdf; Supplier: LCSC; Supply Voltage: 10V~50V; Output Current: 20A; Interface: SPI,STEP/DIR; Operating Temperature: -40℃~+125℃@(Tj)
U5 = STM32F103RBT6: CPU内核:ARM Cortex-M3;CPU最大主频:72MHz;工作电压范围:2V~3.6V;程序存储容量:128KB;RAM总容量:20KB;EEPROM/数据 FLASH容量:128KB;GPIO端口数量:51;ADC(位数):12bit;DAC(位数):-;(E)PWM(位数):-;外设/功能:看门狗；DMA；看门狗；片载温度传感器;内部振荡器:有;工作温度范围:-40℃~+85℃;; LCSC Part Name: ARM Cortex-M3 72MHz; Supplier Part: C8735; Manufacturer: ST(意法半导体); Supplier Footprint: LQFP-64(10x10); JLCPCB Part Class: Extended Part; Datasheet: https://atta.szlcsc.com/upload/public/pdf/source/20140531/1457707089452.pdf; Supplier: LCSC; CPU Core: ARM Cortex-M3; CPU Maximum Speed: 72MHz; Operating Voltage Range: 2V~3.6V; Program Storage Size: 128KB; Program Memory Type: FLASH; RAM Size: 20KB; EEPROM: 128KB; GPIO Ports Number: 51; ADC (Bit): 12bit; Peripheral/Function: 看门狗；DMA；看门狗；片载温度传感器; Internal Oscillator: 有; Operating Temperature Range: -40℃~+85℃
U6-U13 = AO4882_C477943: 类型:-;漏源电压(Vdss):-;连续漏极电流(Id):-;功率(Pd):-;导通电阻(RDS(on)@Vgs,Id):-;阈值电压(Vgs(th)@Id):-;栅极电荷(Qg@Vgs):-;输入电容(Ciss@Vds):-;反向传输电容(Crss@Vds):-;; Supplier Part: C477943; Manufacturer: AOS; Supplier Footprint: SOIC-8; JLCPCB Part Class: Extended Part; Datasheet: https://atta.szlcsc.com/upload/public/pdf/source/20200102/C477943_EA5ED58D99E2A29196D99167F6C943AE.pdf; Supplier: LCSC
X1 = X49SM8MSD2SC: 晶振类型:49SMD;频率:8MHz;频率公差:±20ppm;频率稳定度:±30ppm;负载电容:20pF;工作温度:-20℃~+70℃;; LCSC Part Name: HC-49SMD 8MHz ±20ppm 20pF; Supplier Part: C12674; Manufacturer: YXC(扬兴晶振); Supplier Footprint: HC-49S-SMD-2P; JLCPCB Part Class: Basic Part; Datasheet: https://atta.szlcsc.com/upload/public/pdf/source/20210329/C106809_0E91E60850A780B284B63D653DC40EA4.pdf; Supplier: LCSC; Crystal Type: 49SMD; Frequency Tolerance: ±20ppm; Frequency Stability: ±30ppm; Load Capacitance: 20pF; Operating Temperature: -20℃~+70℃
R60 = 0603WAF1200T5E: 精度:±1%;功率:1/10W;电阻类型:厚膜电阻;最大工作电压:75V;温度系数:±100ppm/℃;工作温度范围:-55℃~+155℃;阻值:120Ω;; LCSC Part Name: 120Ω ±1%; Supplier Part: C22787; Manufacturer: UNI-ROYAL(厚声); Supplier Footprint: 0603; JLCPCB Part Class: Basic Part; Datasheet: https://atta.szlcsc.com/upload/public/pdf/source/20200306/C422600_1E6D84923E4A46A82E41ADD87F860B5C.pdf; Supplier: LCSC; Tolerance: ±1%; Power(Watts): 1/10W; Type: 厚膜电阻; Overload Voltage (Max): 75V; Temperature Coefficient: ±100ppm/℃; Operating Temperature Range: -55℃~+155℃
U14 = TJA1050T/CM,118: 类型:收发器;协议类别:CAN总线;; Supplier Part: C6952; Manufacturer: NXP(恩智浦); Supplier Footprint: SOIC-8_150mil; JLCPCB Part Class: Basic Part; Datasheet: https://atta.szlcsc.com/upload/public/pdf/source/20140411/1457707042917.pdf; Supplier: LCSC; Type: 收发器; Protocol: CAN总线; Supply Voltage: 4.75V ~ 5.25V

## Nets
3V3: C3.1 C16.2 C17.2 C18.2 C23.2 C24.2 C25.2 C31.2 CN5.1 CN9.1 CN10.1 CN11.1 CN12.1 H1.1 R1.1 R37.2 R57.1 U2.2(VOUT) U2.4(VOUT) U5.1(VBAT) U5.13(VDDA) U5.19(VDD_4) U5.32(VDD_1) U5.48(VDD_2) U5.64(VDD_3)
3V3_OUT: R34.1 U5.40(PC9)
5V: C4.1 C19.2 C20.2 C36.1 CN13.1 CN14.1 CN15.1 CN17.1 L1.2 R11.2 R13.2 U1.3(FB) U2.3(VIN) U3.20(VCC_IO) U3.22(SPI_MODE) U4.20(VCC_IO) U4.22(SPI_MODE) U14.3(VCC)
5V_OUT: R54.1 U5.39(PC8)
DGND: C5.2 C6.2 C7.2 C8.2 C9.2 C12.1 C13.1 C16.1 C17.1 C18.1 C19.1 C20.1 C21.1 C22.1 C23.1 C24.1 C25.1 C31.1 C36.2 CN5.3 CN6.3 CN7.3 CN8.3 CN10.4 CN11.4 H1.4 Q1.2(E) R4.2 R8.2 R9.1 R10.1 R12.1 U3.6(GNDA) U3.11(TST_MODE) U3.12(CLK) U3.19(GNDD) U3.28(DRV_ENN) U3.30(GNDD) U3.49(EP) U4.6(GNDA) U4.11(TST_MODE) U4.12(CLK) U4.19(GNDD) U4.28(DRV_ENN) U4.30(GNDD) U4.49(EP) U5.12(VSSA) U5.18(VSS_4) U5.31(VSS_1) U5.47(VSS_2) U5.63(VSS_3) U14.2(GND) U14.8(S)
PGND: C1.2 C2.1 C3.2 C4.2 C29.1 C30.1 C35.2 C37.1 C39.1 C41.1 C43.1 C44.1 C45.1 CN1.2 CN1.4 CN16.2 D1.2(A) DC1.2 DC1.3 LED1.1(C) LED2.1(C) Q2.2(S) Q4.2(S) Q5.2(S) Q6.2(S) Q8.2(S) R4.1 R19.1 R23.1 R25.1 R27.1 R35.1 R38.1 R41.1 R43.1 R45.1 R48.1 R51.1 R52.1 R53.2 R56.1 R59.1 TV1.2(A) TV2.2(A) U1.5(GND) U1.6(GND) U1.7(GND) U1.8(GND) U2.1(GND)
VIN: C1.1 C2.2 F1.2 R3.1 U1.1(VIN)
850NM_LIGHT: R58.1 U5.27(PB1)
BODY_SENSOR: CN5.2 U5.56(PB4)
BOOT0: R8.1 U5.60(BOOT0)
BOOT1: R9.2 U5.28(PB2BOOT1)
CAN_RX: U5.61(PB8) U14.4(RXD)
CAN_TX: U5.62(PB9) U14.1(TXD)
DATA_LIGHT: R50.1 U5.11(PC3)
I2C1_SCL: CN10.2 U5.58(PB6)
I2C1_SDA: CN10.3 U5.59(PB7)
I2C2_SCL: CN11.2 U5.29(PB10)
I2C2_SDA: CN11.3 U5.30(PB11)
IR_38KHZ: R29.2 U5.37(PC6)
LASER_LIGHT: R49.1 U5.10(PC2)
M1_5VOUT: C8.1 R5.2 U3.5(5VOUT)
M1_BMA1: C28.1 CN3.4 U3.40(BMA1) U6.3(S1) U8.5(D1) U8.6(D1)
M1_BMA2: C26.1 CN3.3 U3.37(BMA2) U6.1(S2) U8.7(D2) U8.8(D2)
M1_BMB1: C38.1 CN3.2 U3.48(BMB1) U10.3(S1) U12.5(D1) U12.6(D1)
M1_BMB2: C33.1 CN3.1 U3.45(BMB2) U10.1(S2) U12.7(D2) U12.8(D2)
M1_CA1: C28.2 U3.42(CA1)
M1_CA2: C26.2 U3.35(CA2)
M1_CB1: C38.2 U3.2(CB1)
M1_CB2: C33.2 U3.43(CB2)
M1_HA1: R15.1 U3.41(HA1)
M1_HA2: R14.1 U3.36(HA2)
M1_HB1: R32.1 U3.1(HB1)
M1_HB2: R30.1 U3.44(HB2)
M1_LA1: R24.1 U3.39(LA1)
M1_LA2: R20.1 U3.38(LA2)
M1_LB1: R42.1 U3.47(LB1)
M1_LB2: R39.1 U3.46(LB2)
M1_SA: R18.2 R19.2 U8.1(S2) U8.3(S1)
M1_SB: R36.2 R38.2 U12.1(S2) U12.3(S1)
M1_SRAH: R18.1 U3.8(SRAH)
M1_SRAL: R23.2 U3.7(SRAL)
M1_SRBH: R36.1 U3.9(SRBH)
M1_SRBL: R41.2 U3.10(SRBL)
M1_VCC: C21.2 R5.1 U3.29(VCC)
M2_5VOUT: C9.1 R6.2 U4.5(5VOUT)
M2_BMA1: C32.1 CN4.4 U4.40(BMA1) U7.3(S1) U9.5(D1) U9.6(D1)
M2_BMA2: C27.1 CN4.3 U4.37(BMA2) U7.1(S2) U9.7(D2) U9.8(D2)
M2_BMB1: C40.1 CN4.2 U4.48(BMB1) U11.3(S1) U13.5(D1) U13.6(D1)
M2_BMB2: C34.1 CN4.1 U4.45(BMB2) U11.1(S2) U13.7(D2) U13.8(D2)
M2_CA1: C32.2 U4.42(CA1)
M2_CA2: C27.2 U4.35(CA2)
M2_CB1: C40.2 U4.2(CB1)
M2_CB2: C34.2 U4.43(CB2)
M2_HA1: R17.1 U4.41(HA1)
M2_HA2: R16.1 U4.36(HA2)
M2_HB1: R33.1 U4.1(HB1)
M2_HB2: R31.1 U4.44(HB2)
M2_LA1: R28.1 U4.39(LA1)
M2_LA2: R26.1 U4.38(LA2)
M2_LB1: R46.1 U4.47(LB1)
M2_LB2: R44.1 U4.46(LB2)
M2_SA: R21.2 R25.2 U9.1(S2) U9.3(S1)
M2_SB: R40.2 R43.2 U13.1(S2) U13.3(S1)
M2_SRAH: R21.1 U4.8(SRAH)
M2_SRAL: R27.2 U4.7(SRAL)
M2_SRBH: R40.1 U4.9(SRBH)
M2_SRBL: R45.2 U4.10(SRBL)
M2_VCC: C22.2 R6.1 U4.29(VCC)
M_VIN: C10.1 C11.1 C29.2 C30.2 C35.1 C37.2 C39.2 C41.2 C43.2 C44.2 C45.2 F2.2 R2.1 R3.2 U3.4(VSA) U3.33(VS) U4.4(VSA) U4.33(VS) U6.5(D1) U6.6(D1) U6.7(D2) U6.8(D2) U7.5(D1) U7.6(D1) U7.7(D2) U7.8(D2) U10.5(D1) U10.6(D1) U10.7(D2) U10.8(D2) U11.5(D1) U11.6(D1) U11.7(D2) U11.8(D2)
M_VS: CN1.1 CN1.3 F2.1 TV2.1(C)
NRST: C5.1 U5.7(NRST)
OSC_IN: R7.2 U5.5(PD0 OSC_IN)
OSC_OUT: C13.2 U5.6(PD1 OSC_OUT) X1.1(OSC1)
SPI1_MISO: U3.15(SDI_CFG1) U5.22(PA6)
SPI1_MOSI: U3.16(SDO_CFG0) U5.23(PA7)
SPI1_NSS: U3.13(CSN_CFG3) U5.20(PA4)
SPI1_SCK: U3.14(SCK_CFG2) U5.21(PA5)
SPI2_MISO: U4.15(SDI_CFG1) U5.35(PB14)
SPI2_MOSI: U4.16(SDO_CFG0) U5.36(PB15)
SPI2_NSS: U4.13(CSN_CFG3) U5.33(PB12)
SPI2_SCK: U4.14(SCK_CFG2) U5.34(PB13)
STATUS_BLUE: R47.1 U5.26(PB0)
STATUS_RED: R55.1 U5.25(PC5)
SWCLK: H1.3 U5.49(PA14)
SWDIO: H1.2 U5.46(PA13)
UART1_RX: CN6.2 U5.43(PA10)
UART1_TX: CN6.1 U5.42(PA9)
UART2_RX: CN7.2 U5.17(PA3)
UART2_TX: CN7.1 U5.16(PA2)
UART3_RX: CN8.2 U5.52(PC11)
UART3_TX: CN8.1 U5.51(PC10)
$1N12331: DC1.1 F1.1 TV1.1(C)
$1N13220: D1.1(K) L1.1 U1.2(OUTPUT)
$1N14900: LED1.2(A) R1.2
$1N23437: C12.2 R7.1 X1.2(OSC2)
$1N23917: CN9.2 R22.2
$1N24094: Q1.3(C) R22.1
$1N24137: Q1.1(B) R29.1
$1N24876: CN16.1 Q3.2(S)
$1N25138: CN16.3 Q7.2(S)
$1N25168: CN12.2 Q2.3(D)
$1N25428: CN15.2 Q6.3(D)
$1N25552: Q3.1(G) R47.2 R48.2
$1N25560: Q7.1(G) R53.1 R55.2
$1N28030: R12.2 R13.1 U4.21(SD_MODE)
$1N28152: R10.2 R11.1 U3.21(SD_MODE)
$1N28672: C14.1 U3.31(CPO)
$1N28681: C14.2 U3.32(CPI)
$1N28690: C15.1 U4.31(CPO)
$1N28997: C6.1 U3.3(12VOUT)
$1N29274: C7.1 U4.3(12VOUT)
$1N31689: C10.2 U3.34(VCP)
$1N31727: C15.2 U4.32(CPI)
$1N31732: C11.2 U4.34(VCP)
$1N32608: R14.2 U6.2(G2)
$1N32656: R15.2 U6.4(G1)
$1N33019: R16.2 U7.2(G2)
$1N33022: R17.2 U7.4(G1)
$1N33512: LED2.2(A) R2.2
$1N33697: R20.2 U8.2(G2)
$1N33699: R24.2 U8.4(G1)
$1N34248: R30.2 U10.2(G2)
$1N34253: R32.2 U10.4(G1)
$1N34300: R39.2 U12.2(G2)
$1N34302: R42.2 U12.4(G1)
$1N35035: R26.2 U9.2(G2)
$1N35037: R28.2 U9.4(G1)
$1N35064: R31.2 U11.2(G2)
$1N35069: R33.2 U11.4(G1)
$1N35116: R44.2 U13.2(G2)
$1N35118: R46.2 U13.4(G1)
$1N40105: Q6.1(G) R54.2 R56.2
$1N40144: Q2.1(G) R34.2 R35.2
$1N44076: Q3.3(D) R37.1
$1N44149: Q7.3(D) R57.2
$1N44323: CN14.2 Q5.3(D)
$1N44344: Q5.1(G) R50.2 R52.2
$1N57216: Q8.1(G) R58.2 R59.2
$1N57231: CN17.2 Q8.3(D)
$1N61363: CN13.2 Q4.3(D)
$2N566: CN2.1 R60.2 U14.7(CANH)
$2N570: CN2.2 R60.1 U14.6(CANL)
Net-(R49-2): R49.2 R51.2

Not connected (* = marked no-connect by the designer): Q4 1(G); U1 4(ON/OFF)*; U3 17(REFL_STEP)* 18(REFR_DIR)* 23(ENCB_DCEN_CFG4)* 24(ENCA_DCIN_CFG5)* 25(ENCN_DCO_CFG6)* 26(DIAG0_SWN)* 27(DIAG1_SWP)*; U4 17(REFL_STEP)* 18(REFR_DIR)* 23(ENCB_DCEN_CFG4)* 24(ENCA_DCIN_CFG5)* 25(ENCN_DCO_CFG6)* 26(DIAG0_SWN)* 27(DIAG1_SWP)*; U5 2(PC13-TAMPER-RTC)* 3(PC14-OSC32_IN)* 4(PC15-OSC32_OUT)* 8(PC0)* 9(PC1)* 14(PA0-WKUP)* 15(PA1)* 24(PC4)* 38(PC7)* 41(PA8)* 44(PA11)* 45(PA12)* 50(PA15)* 53(PC12)* 54(PD2)* 55(PB3)* 57(PB5)*; U14 5(VREF)*

## Notes on the sheets
sheet 1
- 电源指示灯
- 地平面连接
- LDO降压3.3V
- 12V-24V直流输入
- 电机双路12V-24V直流输入
- DCDC降压5V
- 步进驱动1（X轴）
- 步进驱动2（Y轴）
- R10和R11只能二选一焊
- R12和R13只能二选一焊
- MCU外围电路
- 人体热敏传感引出
- 三路UART（航插两路/主控板一路）引出
- 红外遥控38KHZ调制
- 两路I2C（OLED屏幕/激光测距传感）引出
- 灯光控制引出
- OpenMOSS
- 扩展驱动（3.3V/5V）
